# Altium schematic sheet 1_panel.schdoc: Solar Cells
size A4; Engineer: Eng_2_ALT; SheetNumber: 2; SheetTotal: 2; Designed by: Marina Duailibe; Version: v0.1
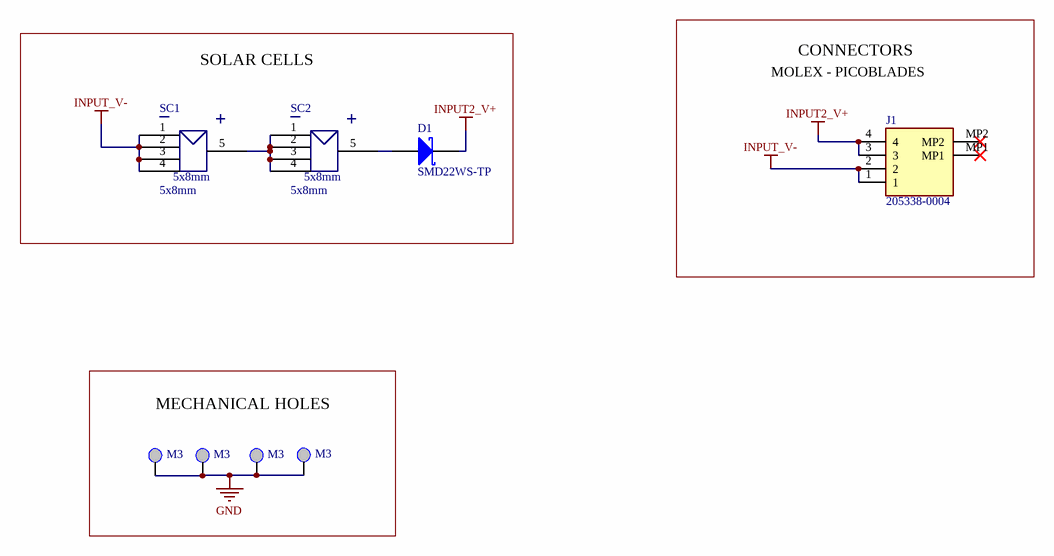
[diagram p0: 1_panel.schdoc]

## Parts
D1  SMD22WS-TP  [SOD323F]
J1  205338-0004  [MOLEX_4PIN_HEADER]
MEC1  M3  [HOLE6x6mm]  (no BOM)
MEC2  M3  [HOLE6x6mm]  (no BOM)
MEC3  M3  [HOLE6x6mm]  (no BOM)
MEC4  M3  [HOLE6x6mm]  (no BOM)
SC1  5x8mm  [SOLAR_CELL]
SC2  5x8mm  [SOLAR_CELL]

## Blocks framed on the sheet
CONNECTORS: J1
SOLAR CELLS: D1 SC1 SC2
MECHANICAL HOLES: MEC1-MEC4

## Nets
GND: MEC1.0 MEC2.0 MEC3.0 MEC4.0
INPUT2_V+: D1.1(K) J1.3 J1.4
INPUT_V-: J1.1 J1.2 SC1.1(V+) SC1.2(V-) SC1.3 SC1.4
NetD1_2: D1.2(A) SC2.5
NetSC1_5: SC1.5 SC2.1(V+) SC2.2(V-) SC2.3 SC2.4

Not connected (* = marked no-connect by the designer): J1 MP1* MP2*

## Notes on the sheet
- MOLEX - PICOBLADES
- Project:
- SpaceLab - Federal University of Santa Catarina
- Title:
- Designed by:
- Project Code:
- Date:
- Revision:
- Sheet
- of
- Size:
- A4
- (in symbol SOLAR CELL) _; +

## Library data of the parts
D1 = DIODE_SCHOTTKY_20V_2A_SMD22WS-TP: Diode Schottky 20 V 2A Surface Mount SOD-323; Partnumber: SMD22WS-TP
J1 = 205338-0004: Connector; Manufacturer_Name: Molex; Datasheet Link: https://www.molex.com/pdm_docs/sd/2053380004_sd.pdf; Height: 2.8mm; Manufacturer_Part_Number: 205338-0004; Mouser Part Number: 538-205338-0004; Mouser Price/Stock: https://www.mouser.co.uk/ProductDetail/Molex/205338-0004?qs=GedFDFLaBXGldxOQTm%2FukQ%3D%3D
MEC1-MEC4 = M3 hole
SC1 SC2 = SOLAR CELL: Manufacturer: Yim Space; PDM Number: SC-3GA-3